# EAGLE design LOCO-Switch (EAGLE 9.7.0)

## Sheet 1 of 2
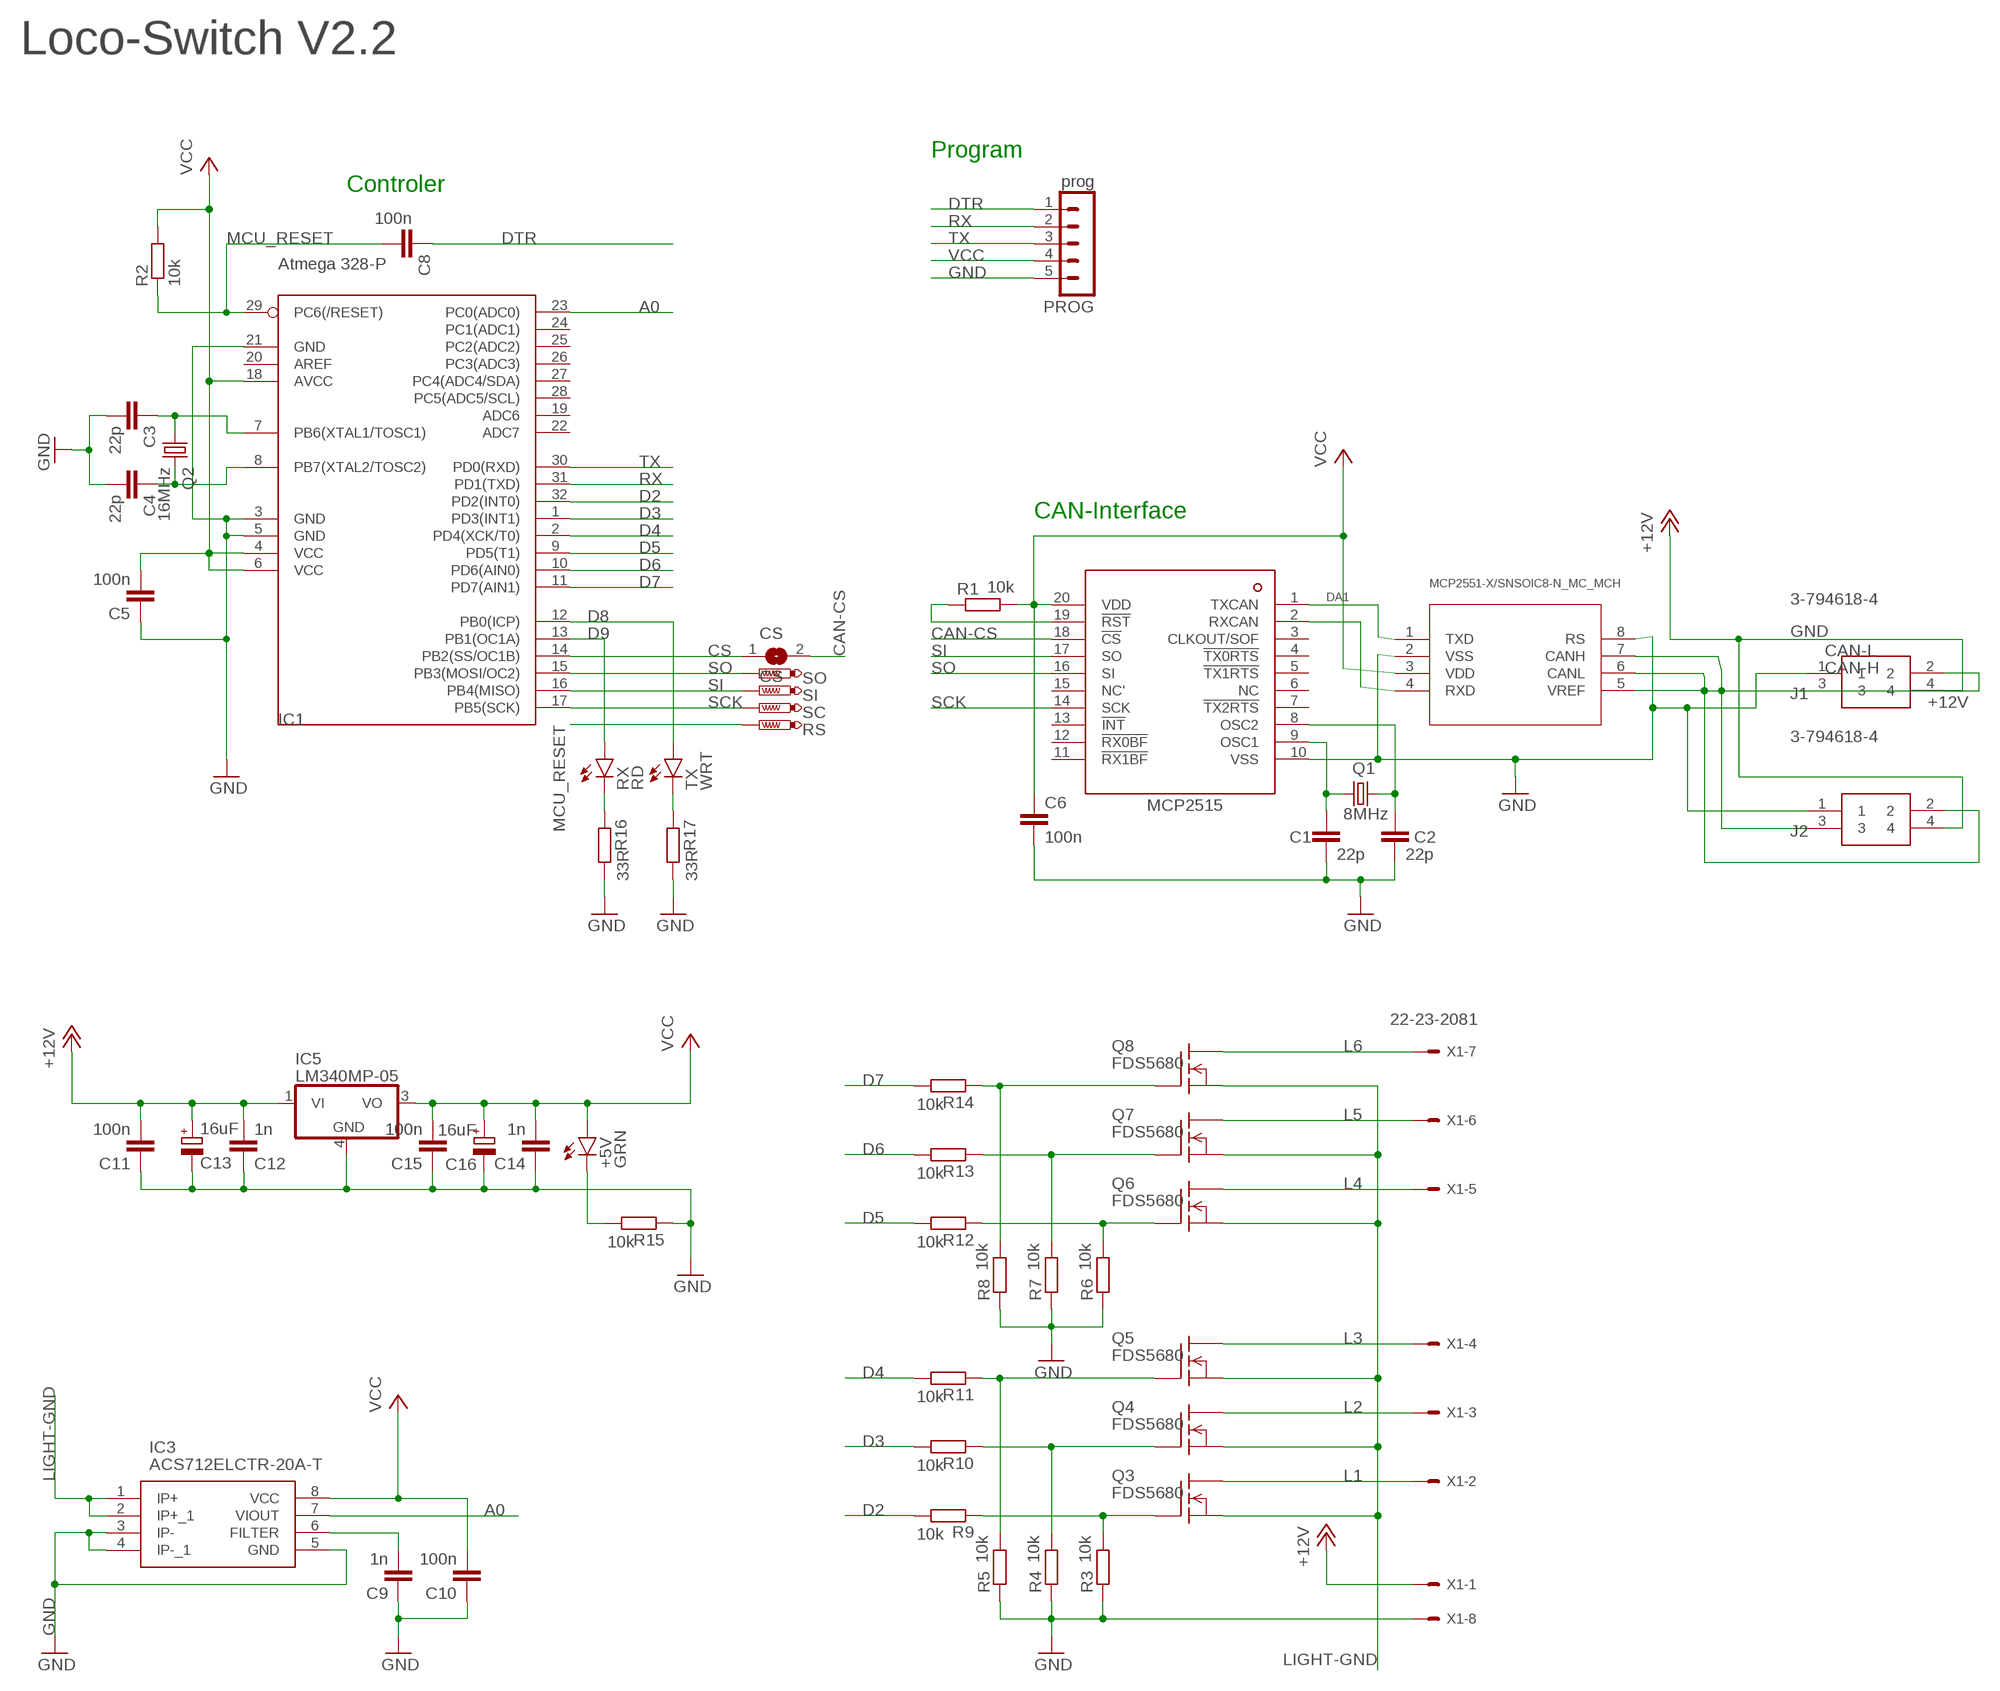
[diagram p0: schematic, sheet 1]

### Parts
+5V  GRN  LEDCHIP-LED0603  [CHIP-LED0603]
C1  22p  C-EUC0402K  [C0402K]
C2  22p  C-EUC0402K  [C0402K]
C3  22p  C-EUC0402K  [C0402K]
C4  22p  C-EUC0402K  [C0402K]
C5  100n  C-EUC0402K  [C0402K]
C6  100n  C-EUC0402K  [C0402K]
C8  100n  C-EUC0402K  [C0402K]
C9  1n  C-EUC0402K  [C0402K]
C10  100n  C-EUC0402K  [C0402K]
C11  100n  C-EUC0402K  [C0402K]
C12  1n  C-EUC0402K  [C0402K]
C13  16uF  CPOL-EUA/3216-18W  [A/3216-18W]
C14  1n  C-EUC0402K  [C0402K]
C15  100n  C-EUC0402K  [C0402K]
C16  16uF  CPOL-EUA/3216-18W  [A/3216-18W]
CS  CS  SJ  [SJ]
DA1  MCP2551-X/SNSOIC8-N_MC_MCH  [SOIC8-N_MC_MCH]
IC1  Atmega 328-P  MEGA8  [TQFP32-08]
IC2  MCP2515  [TSSOP20]
IC3  ACS712ELCTR-20A-T  [SOIC127P600X175-8N]
IC5  LM340MP-05  [SOT223]
J1  3-794618-4  [3-794618-4]
J2  3-794618-4  [3-794618-4]
PROG  prog  MA05-1  [MA05-1]
Q1  8MHz  CRYSTALHC49S  [HC49/S]
Q2  16MHz  CRYSTALHC49S  [HC49/S]
Q3  FDS5680  [SO-8]
Q4  FDS5680  [SO-8]
Q5  FDS5680  [SO-8]
Q6  FDS5680  [SO-8]
Q7  FDS5680  [SO-8]
Q8  FDS5680  [SO-8]
R1  10k  R-EU_R0603  [R0603]
R2  10k  R-EU_R0603  [R0603]
R3  10k  R-EU_R0603  [R0603]
R4  10k  R-EU_R0603  [R0603]
R5  10k  R-EU_R0603  [R0603]
R6  10k  R-EU_R0603  [R0603]
R7  10k  R-EU_R0603  [R0603]
R8  10k  R-EU_R0603  [R0603]
R9  10k  R-EU_R0603  [R0603]
R10  10k  R-EU_R0603  [R0603]
R11  10k  R-EU_R0603  [R0603]
R12  10k  R-EU_R0603  [R0603]
R13  10k  R-EU_R0603  [R0603]
R14  10k  R-EU_R0603  [R0603]
R15  10k  R-EU_R0603  [R0603]
R16  33R  R-EU_R0603  [R0603]
R17  33R  R-EU_R0603  [R0603]
RS  PTR1B1,27  [B1,27]
RX  RD  LEDCHIP-LED0603  [CHIP-LED0603]
SC  PTR1B1,27  [B1,27]
SI  PTR1B1,27  [B1,27]
SO  PTR1B1,27  [B1,27]
TX  WRT  LEDCHIP-LED0603  [CHIP-LED0603]
X1  22-23-2081  [22-23-2081]

### Nets
+12V: C11.2 C12.2 C13.+ IC5.1(VI) J1.4 J2.4 X1.1
A0: IC1.23(PC0(ADC0)) IC3.7(VIOUT)
CAN-CS: CS.2 IC2.18(!CS)
CAN-H: DA1.7(CANH) J1.3 J2.3
CAN-L: DA1.5(VREF) DA1.6(CANL) J1.2 J2.2
CAN-OCC1: C1.1 IC2.9(OSC1) Q1.1
CAN-OCC2: C2.1 IC2.8(OSC2) Q1.2
CS: CS.1 IC1.14(PB2(SS/OC1B))
D2: IC1.32(PD2(INT0)) R9.2
D3: IC1.1(PD3(INT1)) R10.2
D4: IC1.2(PD4(XCK/T0)) R11.2
D5: IC1.9(PD5(T1)) R12.2
D6: IC1.10(PD6(AIN0)) R13.2
D7: IC1.11(PD7(AIN1)) R14.2
D8: IC1.12(PB0(ICP)) TX.A
D9: IC1.13(PB1(OC1A)) RX.A
DTR: C8.1 PROG.1
GND: C1.2 C2.2 C3.2 C4.2 C5.1 C6.2 C9.1 C10.1 C11.1 C12.1 C13.- C14.1 C15.1 C16.- DA1.2(VSS) DA1.8(RS) IC1.3(GND) IC1.5(GND) IC1.21(GND) IC2.10(VSS) IC3.3(IP-) IC3.4(IP-_1) IC3.5(GND) IC5.4(GND) J1.1 J2.1 PROG.5 R3.1 R4.1 R5.1 R6.1 R7.1 R8.1 R15.1 R16.2 R17.2 X1.8
L1: Q3.5(D) Q3.6(D) Q3.7(D) Q3.8(D) X1.2
L2: Q4.5(D) Q4.6(D) Q4.7(D) Q4.8(D) X1.3
L3: Q5.5(D) Q5.6(D) Q5.7(D) Q5.8(D) X1.4
L4: Q6.5(D) Q6.6(D) Q6.7(D) Q6.8(D) X1.5
L5: Q7.5(D) Q7.6(D) Q7.7(D) Q7.8(D) X1.6
L6: Q8.5(D) Q8.6(D) Q8.7(D) Q8.8(D) X1.7
LIGHT-GND: IC3.1(IP+) IC3.2(IP+_1) Q3.1(S) Q3.2(S) Q3.3(S) Q4.1(S) Q4.2(S) Q4.3(S) Q5.1(S) Q5.2(S) Q5.3(S) Q6.1(S) Q6.2(S) Q6.3(S) Q7.1(S) Q7.2(S) Q7.3(S) Q8.1(S) Q8.2(S) Q8.3(S)
MCU_RESET: C8.2 IC1.29(PC6(/RESET)) R2.1 RS.TP
N$1: C9.2 IC3.6(FILTER)
N$2: Q3.4(G) R3.2 R9.1
N$3: Q4.4(G) R4.2 R10.1
N$4: Q5.4(G) R5.2 R11.1
N$5: Q6.4(G) R6.2 R12.1
N$6: IC2.19(!RST) R1.1
N$7: Q7.4(G) R7.2 R13.1
N$8: Q8.4(G) R8.2 R14.1
N$9: R16.1 RX.C
N$10: C3.1 IC1.7(PB6(XTAL1/TOSC1)) Q2.1
N$11: C4.1 IC1.8(PB7(XTAL2/TOSC2)) Q2.2
N$12: +5V.C R15.2
N$13: R17.1 TX.C
RX: IC1.31(PD1(TXD)) PROG.2
RXCAN: DA1.4(RXD) IC2.2(RXCAN)
SCK: IC1.17(PB5(SCK)) IC2.14(SCK) SC.TP
SI: IC1.16(PB4(MISO)) IC2.17(SO) SI.TP
SO: IC1.15(PB3(MOSI/OC2)) IC2.16(SI) SO.TP
TX: IC1.30(PD0(RXD)) PROG.3
TXCAN: DA1.1(TXD) IC2.1(TXCAN)
VCC: +5V.A C5.2 C6.1 C10.2 C14.2 C15.2 C16.+ DA1.3(VDD) IC1.4(VCC) IC1.6(VCC) IC1.18(AVCC) IC2.20(VDD) IC3.8(VCC) IC5.3(VO) PROG.4 R1.2 R2.2
Unconnected: IC1.19(ADC6) IC1.20(AREF) IC1.22(ADC7) IC1.24(PC1(ADC1)) IC1.25(PC2(ADC2)) IC1.26(PC3(ADC3)) IC1.27(PC4(ADC4/SDA)) IC1.28(PC5(ADC5/SCL)) IC2.3(CLKOUT/SOF) IC2.4(!TX0RTS) IC2.5(!TX1RTS) IC2.6(NC) IC2.7(!TX2RTS) IC2.11(!RX1BF) IC2.12(!RX0BF) IC2.13(!INT) IC2.15(NC')

### Notes on the sheet
- Loco-Switch V2.2
- Program
- Controler
- CAN-Interface

## Sheet 2 of 2

## Library data of the parts
+5V RX TX = led:LED: LED OSRAM: - CHIPLED LG R971, LG N971, LY N971, LG Q971, LY Q971, LO R971, LY R971 LH N974, LH R974 LS Q976, LO Q976, LY Q976 LO Q996 - Hyper CHIPLED LW Q18S LB Q993, LB Q99A, LB R99A - SideLED LS A670, LO A670, LY A670, LG A670, LP A670 LB A673, LV A673, LT A673, LW A673 LH A674 LY A675 LS A676, LA A676, LO A676, LY A676, LW A676 LS A679, LY A679, LG A679 - Hyper Micro SIDELED® LS Y876, LA Y876, LO Y876, LY Y876 LT Y87S - SmartLED LW L88C, LW L88S LB L89C, LB L89S, LG L890 LS L89K, LO L89K, LY L89K LS L896, LA L896, LO L896, LY L896 - TOPLED LS T670, LO T670, LY T670, LG T670, LP T670 LSG T670, LSP T670, LSY T670, LOP T670, LYG T670 LG T671, LOG T671, LSG T671 LB T673, LV T673, LT T673, LW T673 LH T674 LS T676, LA T676, LO T676, LY T676, LB T676, LH T676, LSB T676, LW T676 LB T67C, LV T67C, LT T67C, LS T67K, LO T67K, LY T67K, LW E67C LS E67B, LA E67B, LO E67B, LY E67B, LB E67C, LV E67C, LT E67C LW T67C LS T679, LY T679, LG T679 LS T770, LO T770, LY T770, LG T770, LP T770 LB T773, LV T773, LT T773, LW T773 LH T774 LS E675, LA E675, LY E675, LS T675 LS T776, LA T776, LO T776, LY T776, LB T776 LHGB T686 LT T68C, LB T68C - Hyper Mini TOPLED® LB M676 - Mini TOPLED Santana® LG M470 LS M47K, LO M47K, LY M47K Source: http://www.osram.convergy.de LUXEON: - LUMILED® LXK2-PW12-R00, LXK2-PW12-S00, LXK2-PW14-U00, LXK2-PW14-V00 LXK2-PM12-R00, LXK2-PM12-S00, LXK2-PM14-U00 LXK2-PE12-Q00, LXK2-PE12-R00, LXK2-PE12-S00, LXK2-PE14-T00, LXK2-PE14-U00 LXK2-PB12-K00, LXK2-PB12-L00, LXK2-PB12-M00, LXK2-PB14-N00, LXK2-PB14-P00, LXK2-PB14-Q00 LXK2-PR12-L00, LXK2-PR12-M00, LXK2-PR14-Q00, LXK2-PR14-R00 LXK2-PD12-Q00, LXK2-PD12-R00, LXK2-PD12-S00 LXK2-PH12-R00, LXK2-PH12-S00 LXK2-PL12-P00, LXK2-PL12-Q00, LXK2-PL12-R00 Source: www.luxeon.com KINGBRIGHT: KA-3528ASYC Source: www.kingbright.com
C1-C6 C8-C12 C14 C15 = rcl:C-EU: CAPACITOR, European symbol; SPICEPREFIX: C
C13 C16 = rcl:CPOL-EU: POLARIZED CAPACITOR, European symbol; SPICEPREFIX: C
CS = jumper:SJ: SMD solder JUMPER
DA1 = MCP2551:MCP2551-X/SN; COPYRIGHT: Copyright (C) 2023 Ultra Librarian. All rights reserved.; MANUFACTURER_PART_NUMBER: MCP2551-X/SN; MFR_NAME: Microchip
IC1 = atmel:MEGA8: MICROCONTROLLER 8 Kbytes FLASH, 1 kbytes SRAM, 512 bytes EEPROM, USART, 6-channel 10 bit ADC, 2-channel 8 bit ADC Pin compatible with Atmega48, ATMega88, ATMega168 Source: avr.lbr
IC2 = MCP2515:MCP2515: Microchip Technology’s MCP2515 is a stand-alone Controller Area Network (CAN) controller that implements the CAN specification, version 2.0B. It is capable of transmitting and receiving both standard and extended data and remote frames. The MCP2515 has two acceptance masks and six acceptance filters that are used to filter out unwanted messages, thereby reducing the host MCUs overhead. The MCP2515 interfaces with microcontrollers (MCUs) via an industry standard Serial Peripheral Interface (SPI).
IC3 = SamacSys_Parts:ACS712ELCTR-20A-T: ACS712ELCTR-20A-T, Hall Effect Sensor 5V 8-Pin SOIC, SOIC N Source: Datasheet <http://uk.rs-online.com/web/p/products/6807135P>; ALLIED_NUMBER: R1076682; DESCRIPTION: ACS712ELCTR-20A-T, Hall Effect Sensor 5V 8-Pin SOIC, SOIC N; HEIGHT: 1.75mm; MANUFACTURER_NAME: Allegro Microsystems; MANUFACTURER_PART_NUMBER: ACS712ELCTR-20A-T; RS_PART_NUMBER: 6807135P; RS_PRICE-STOCK: http://uk.rs-online.com/web/p/products/6807135P
IC5 = linear:LM340?-*: Positive VOLTAGE REGULATOR Source: http://cache.national.com/ds/LM/LM340.pdf
J1 J2 = Micro Mate-N-Lok:3-794618-4: 4 way 2 row r/a header Mate-N-Lok Source: Datasheet <https://rs.componentsearchengine.com/Datasheets/2/3-794618-4.pdf>; DESCRIPTION: 4 way 2 row r/a header Mate-N-Lok; HEIGHT: 7.37mm; MANUFACTURER_NAME: TE Connectivity; MANUFACTURER_PART_NUMBER: 3-794618-4
PROG = lst-b:MA05-1: PIN HEADER; OC_FARNELL: unknown; OC_NEWARK: unknown
Q1 Q2 = crystal:CRYSTAL: CRYSTAL; OC_FARNELL: 1667008; OC_NEWARK: unknown
Q3-Q8 = transistor-fet:FDS5680: 60V N-Channel PowerTrench TM MOSFET FAIRCHILD FDS5680.pdf
R1-R17 = rcl:R-EU_: RESISTOR, European symbol; SPICEPREFIX: R
RS SC SI SO = testpad:PTR1: TEST PIN
X1 = con-molex:22-23-2081: .100" (2.54mm) Center Header - 8 Pin; MF: MOLEX; MPN: 22-23-2081; OC_FARNELL: 1756826; OC_NEWARK: 01C7592

## Board
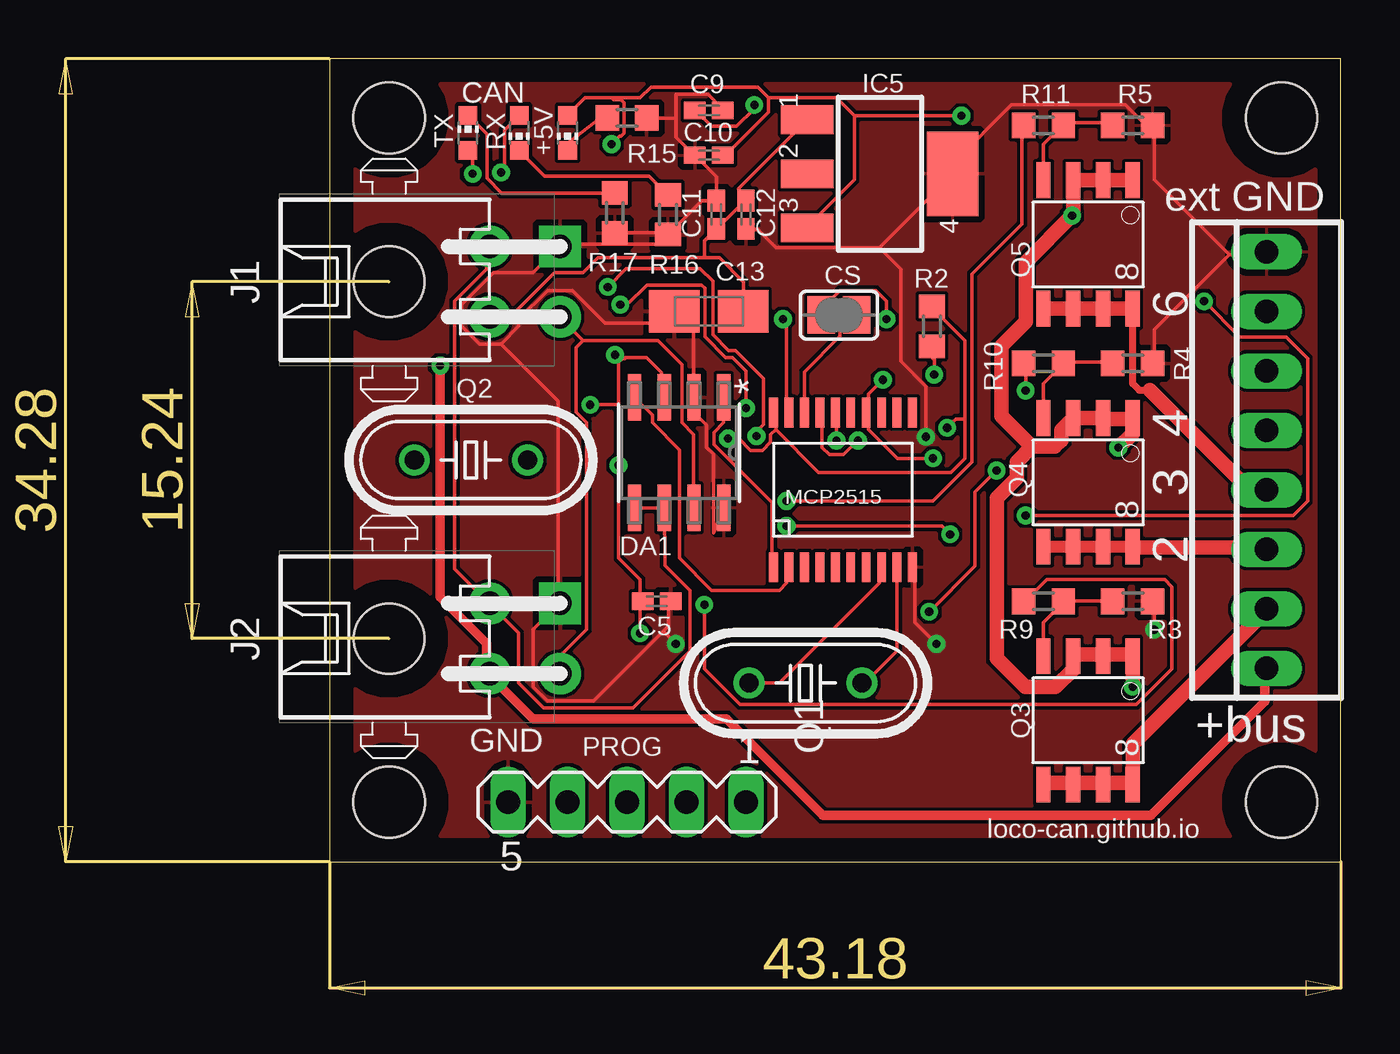
[diagram p1: board, top side]
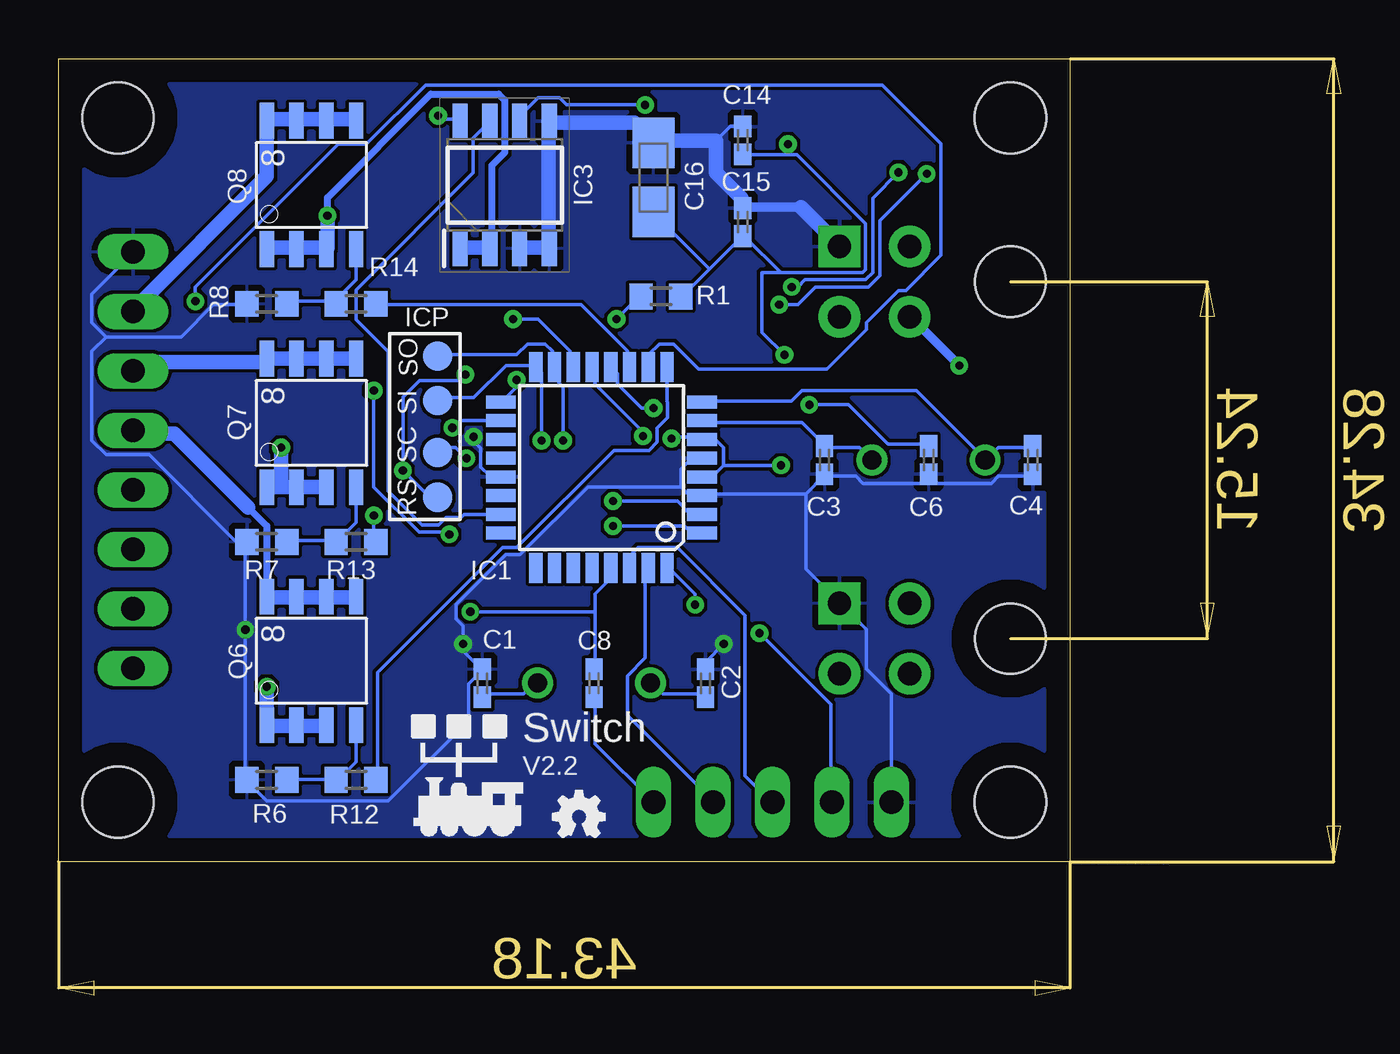
[diagram p2: board, bottom side, seen from below]

Size 43.18 x 34.29 mm. Coordinates in mm from the lower left corner, seen from the top.
Outline: 0,0 43.18,0 43.18,34.29 0,34.29 0,0
Copper layers (1*16): Top / Bottom
Stack-up Default Layer Stack: Top User Defined 0.035mm / Dielectric-1 User Defined 1.5mm / Bottom User Defined 0.035mm
Design rules "default": minimum track width 6mil, minimum drill 0.35mm, track to track 6mil, track to pad 6mil, pad to pad 6mil, via to via 6mil, smd to smd 6mil, copper to edge 40mil, drill to drill 6mil, minimum pad ring 10mil, minimum via ring 8mil, stop-mask expansion 4mil, vias tented up to drill 0mil, thermal gap 10mil
Holes 3.05 mm at 40.64,2.54 40.64,31.75 2.54,2.54 2.54,31.75

### Footprints (pad centres in the part's own frame; a part is rotated, then mirrored left to right if it is on the bottom)
CHIP-LED0603 = smd 0.8 x 0.8: A 0,-0.75; C 0,0.75
C0402K = smd 0.925 x 0.74: 1 -0.6,0; 2 0.6,0
A/3216-18W = smd 2.15 x 1.8: + 1.475,0; - -1.475,0
SJ = smd 1.168 x 1.6: 1 -0.762,0; 2 0.762,0
SOIC8-N_MC_MCH = smd 1.981 x 0.559: 1 -2.362,1.905; 2 -2.362,0.635; 3 -2.362,-0.635; 4 -2.362,-1.905; 5 2.362,-1.905; 6 2.362,-0.635; 7 2.362,0.635; 8 2.362,1.905
TQFP32-08 = smd 1.27 x 0.559: 1 -4.293,2.8; 2 -4.293,2; 3 -4.293,1.2; 4 -4.293,0.4; 5 -4.293,-0.4; 6 -4.293,-1.2; 7 -4.293,-2; 8 -4.293,-2.8; 17 4.293,-2.8; 18 4.293,-2; 19 4.293,-1.2; 20 4.293,-0.4; 21 4.293,0.4; 22 4.293,1.2; 23 4.293,2; 24 4.293,2.8 | smd 0.559 x 1.27: 9 -2.8,-4.293; 10 -2,-4.293; 11 -1.2,-4.293; 12 -0.4,-4.293; 13 0.4,-4.293; 14 1.2,-4.293; 15 2,-4.293; 16 2.8,-4.293; 25 2.8,4.293; 26 2,4.293; 27 1.2,4.293; 28 0.4,4.293; 29 -0.4,4.293; 30 -1.2,4.293; 31 -2,4.293; 32 -2.8,4.293
TSSOP20 = smd 1.27 x 0.381: 1 -3.302,2.642; 2 -3.302,1.981; 3 -3.302,1.321; 4 -3.302,0.66; 5 -3.302,0; 6 -3.302,-0.66; 7 -3.302,-1.321; 8 -3.302,-1.981; 9 -3.302,-2.642; 10 -3.302,-3.302; 11 3.302,-3.302; 12 3.302,-2.642; 13 3.302,-1.981; 14 3.302,-1.321; 15 3.302,-0.66; 16 3.302,0; 17 3.302,0.66; 18 3.302,1.321; 19 3.302,1.981; 20 3.302,2.642
SOIC127P600X175-8N = smd 1.525 x 0.65: 1 -2.712,1.905; 2 -2.712,0.635; 3 -2.712,-0.635; 4 -2.712,-1.905; 5 2.712,-1.905; 6 2.712,-0.635; 7 2.712,0.635; 8 2.712,1.905
SOT223 = smd 1.219 x 2.235: 1 -2.311,-3.099; 2 0,-3.099; 3 2.311,-3.099 | smd 3.6 x 2.2: 4 0,3.099
3-794618-4 = drill 1 pad 1.778 square: 1 1.5,-7.3 | drill 1 pad 1.778: 2 1.5,-4.3; 3 -1.5,-7.3; 4 -1.5,-4.3 | hole 3: 0,0
MA05-1 = drill 1.016 long: 1 -5.08,0; 2 -2.54,0; 3 0,0; 4 2.54,0; 5 5.08,0
HC49/S = drill 0.813: 1 -2.413,0; 2 2.413,0
SO-8 = smd 1.524 x 0.61: 1 -2.743,1.905; 2 -2.743,0.635; 3 -2.743,-0.635; 4 -2.743,-1.905; 5 2.743,-1.905; 6 2.743,-0.635; 7 2.743,0.635; 8 2.743,1.905
R0603 = smd 1 x 1.1: 1 -0.85,0; 2 0.85,0
B1,27 = smd 1.27 x 1.27: TP 0,0
22-23-2081 = drill 1 long: 1 -8.89,0; 2 -6.35,0; 3 -3.81,0; 4 -1.27,0; 5 1.27,0; 6 3.81,0; 7 6.35,0; 8 8.89,0

### Placement (x,y rotation side)
+5V  10.16,31.11 180 top
C1  25.08,7.62 90 bottom
C2  15.56,7.62 90 bottom
C3  10.48,17.14 270 bottom
C4  1.59,17.14 270 bottom
C5  13.97,11.11 180 top
C6  6.03,17.14 270 bottom
C8  20.32,7.62 90 bottom
C9  16.19,32.07 180 top
C10  16.19,30.16 0 top
C11  16.51,27.62 270 top
C12  17.78,27.62 90 top
C13  16.19,23.5 0 top
C14  13.97,30.8 270 bottom
C15  13.97,27.3 270 bottom
C16  17.78,29.21 270 bottom
CS  21.75,23.34 0 top
DA1  14.92,17.46 270 top
IC1  20,16.83 180 bottom
IC2  21.59,15.88 90 top
IC3  24.13,28.89 90 bottom
IC5  23.5,29.37 270 top
J1  2.54,24.77 90 top
J2  2.54,9.53 90 top
PROG  12.7,2.54 180 top
Q1  20.32,7.62 180 top
Q2  6.03,17.14 180 top
Q3  32.38,6.03 270 top
Q4  32.38,16.19 270 top
Q5  32.38,26.35 270 top
Q6  32.38,8.57 90 bottom
Q7  32.38,18.73 90 bottom
Q8  32.38,28.89 90 bottom
R1  17.46,24.13 0 bottom
R2  25.72,22.86 90 top
R3  34.29,11.11 180 top
R4  34.29,21.27 180 top
R5  34.29,31.43 180 top
R6  34.29,3.49 0 bottom
R7  34.29,13.65 0 bottom
R8  34.29,23.81 0 bottom
R9  30.48,11.11 180 top
R10  30.48,21.27 180 top
R11  30.48,31.43 180 top
R12  30.48,3.49 0 bottom
R13  30.48,13.65 0 bottom
R14  30.48,23.81 0 bottom
R15  12.7,31.75 180 top
R16  14.45,27.62 270 top
R17  12.18,27.7 270 top
RS  26.99,15.56 0 bottom
RX  8.1,31.11 180 top
SC  26.99,17.46 0 bottom
SI  26.99,19.68 0 bottom
SO  26.99,21.59 0 bottom
TX  5.91,31.11 0 top
X1  40.01,17.14 90 top

### Tracks (layer width: path | path; a pad name or v marks a point on that pad's centre or on a via)
+12V  (via drill 0.35)
  Top 0.152: C11.2 16,26.52 16,26.49 | 16,25.78 16,26.49 | C13.+ 17.67,24.75 16.64,25.78 16,25.78 | IC5.1 20.27,31.55 17.46,28.74 C12.2 17.73,28.22 16,26.49 | J1.4 6.86,23.32 7.77,23.32 9.6,25.15 10.82,25.15 11.46,25.78 16,25.78 | 6.86,7.92 J2.4 6.71,8.08
  Top 0.406: 6.86,7.92 8.69,6.09 16.94,6.09 21.06,1.97 35.06,1.97 39.93,6.83 39.93,8.23 X1.1 | v4.72,21.18 4.72,11.29 6.71,9.31 6.71,8.08
  Bottom 0.406: v4.72,21.18 6.71,23.16 J1.4
A0
  Bottom 0.152: IC3.7 25.48,30.89 25.48,29.41 30.48,24.41 30.48,23.14 29.11,21.77 29.11,15.82 27.66,14.38 26.95,14.38 26.63,14.69 26,14.69 25.86,14.83 IC1.23
CAN-CS
  Top 0.152: IC2.18 20.27,20.91 21.8,22.44 21.8,22.62 CS.2
CAN-H
  Top 0.152: 10.82,22.25 14.02,22.25 15.05,21.22 15.05,18.74 15.54,18.24 15.54,14.17 15.55,14.18 DA1.7 | 10.82,22.25 9.91,23.16 J1.3 | 10.82,22.25 10.52,21.95 10.52,19.2 10.97,18.75 10.97,9.91 9.91,8.84 9.91,8.08 J2.3
CAN-L
  Top 0.152: 14.29,15.08 14.33,13.54 14.33,12.65 15.39,11.58 15.39,8.99 12.95,6.55 9.14,6.55 8.08,7.62 8.08,9.75 6.86,10.97 J2.2 6.71,11.12 5.33,12.5 5.33,23.93 6.71,25.3 6.71,26.21 J1.2 | 14.29,15.08 DA1.6 | DA1.5 14.27,15.1 14.29,15.08
CAN-OCC1
  Top 0.152: IC2.9 24.23,8.99 22.86,7.62 Q1.1
  Bottom 0.152: C1.1 24.99,7.16 23.32,7.16 22.86,7.62 Q1.1
CAN-OCC2
  Top 0.152: Q1.2 19.2,7.62 23.47,11.89 23.47,12.5 IC2.8
  Bottom 0.152: C2.1 15.7,7.16 17.37,7.16 17.83,7.62 Q1.2
CS  (via drill 0.35)
  Top 0.152: v23.77,23.16 23.77,23.93 23.32,24.38 21.79,24.38 20.88,23.47 CS.1
  Bottom 0.152: v23.77,23.16 22.71,23.16 21.34,21.79 21.34,21.18 IC1.14
D2  (via drill 0.35)
  Top 0.152: v16,10.97 16,8.23 17.53,6.71 34.44,6.71 35.97,8.23 35.97,11.73 35.66,12.04 30.63,12.04 29.72,11.12 R9.2
  Bottom 0.152: v16,10.97 16,11.43 17.07,12.5 IC1.32
D3  (via drill 0.35)
  Top 0.152: v29.72,20.12 29.72,21.18 R10.2 | v19.51,14.33 26.14,14.33 v26.49,13.97
  Bottom 0.152: v19.51,14.33 16.46,14.33 16.31,14.17 15.85,14.17 IC1.1 | v26.49,13.97 26.59,14.07 27.79,14.07 29.72,16 v29.72,20.12
D4  (via drill 0.35)
  Top 0.152: v19.51,15.39 25.76,15.39 27.43,17.07 27.43,25.09 29.57,27.23 29.57,31.39 R11.2
  Bottom 0.152: v19.51,15.39 16.76,15.39 16.31,14.94 15.85,14.94 IC1.2
D5
  Bottom 0.152: R12.2 29.57,3.5 29.57,8.08 24.23,13.41 23.62,13.41 19.47,17.56 17.98,17.56 17.62,17.92 17.62,18.52 17.17,18.97 17.17,19.62 17.2,19.65 IC1.9
D6  (via drill 0.35)
  Top 0.152: v29.72,14.78 41.15,14.78 41.76,15.39 41.76,21.49 40.84,22.4 38.86,22.4 v37.34,23.93
  Bottom 0.152: v29.72,14.78 29.72,13.72 R13.2 | v37.34,23.93 37.34,24.54 31.24,30.63 30.04,30.63 27.52,33.16 8.01,33.16 5.5,30.66 5.5,25.89 7.01,24.38 7.32,24.38 8.69,23.01 8.69,22.71 10.36,21.03 15.85,21.03 16.92,22.1 17.53,22.1 17.98,21.64 17.98,21.18 IC1.10
D7
  Bottom 0.152: R14.2 29.57,23.77 20.88,23.77 18.9,21.79 18.9,21.18 IC1.11
D8  (via drill 0.35)
  Top 0.152: v12.41,23.78 12.71,23.78 13.55,24.62 15.89,24.62 16.02,24.49 16.02,22.41 16.91,21.52 17.2,21.52 17.78,20.94 v17.78,19.37 | TX.A 6.11,30.16 v6.11,29.37
  Bottom 0.152: IC1.12 19.31,20.83 19.31,20.39 18.29,19.37 v17.78,19.37 | v12.41,23.78 11.62,23.78 10.86,24.54 8.6,24.54 8.11,25.03 8.11,27.37 v6.11,29.37
D9  (via drill 0.35)
  Top 0.152: v18.23,18.17 18.23,18.35 18.53,18.65 18.53,20.62 17.33,21.82 17.04,21.82 16.36,22.5 16.36,24.78 15.82,25.32 12.66,25.32 v11.88,24.54 | v7.32,29.43 7.47,29.57 7.47,31.24 RX.A
  Bottom 0.152: IC1.13 20.27,21.03 20.27,20.39 18.23,18.35 v18.23,18.17 | v11.88,24.54 11.61,24.54 11.31,24.84 8.73,24.84 8.42,25.16 8.42,28.34 v7.32,29.43
DTR
  Bottom 0.152: PROG.1 20.27,5.03 20.27,7.01 C8.1
GND  (via drill 0.35)
  Top 0.152: v35.2,9.91 35.2,10.97 R3.1 | v25.91,9.3 24.99,10.21 24.99,12.5 IC2.10 | 38.41,25.91 35.2,22.71 35.2,21.34 R4.1 | 38.41,25.91 39.93,25.91 X1.8 | 38.41,25.91 35.2,29.11 35.2,31.39 R5.1 35.05,31.55 34.75,31.55 33.98,32.31 29.11,32.31 26.67,29.87 26.67,29.41 IC5.4 26.52,29.26 23.47,26.21 | 23.47,26.21 19.05,26.21 18.29,26.98 17.86,26.98 C12.1 | 23.47,26.21 24.38,25.3 24.38,21.37 25.46,20.29 v25.46,18.14 | 14.17,9.75 11.28,6.86 9.3,6.86 8.69,7.47 8.69,9.91 9.75,10.97 J2.1 9.75,11.12 9.75,19.66 7.32,22.1 | 14.17,9.75 14.48,10.06 14.48,10.97 C5.1 | v14.78,9.3 14.33,9.75 14.17,9.75 | C9.1 16.76,32.16 16.15,32.77 14.78,32.77 14.78,31.75 | 14.78,31.75 R15.1 | R16.2 15.9,28.22 C11.1 16.51,29.25 C10.1 15.54,30.18 14.78,30.94 14.78,31.75 | R16.2 14.24,26.36 9.91,26.36 J1.1 9.75,26.21 8.69,25.15 7.01,25.15 5.64,23.77 5.64,22.86 6.4,22.1 7.32,22.1 | 7.32,22.1 8.08,22.86 8.08,23.16 9.3,24.38 10.36,24.38 11.76,22.99 14.21,22.99 C13.- 14.78,23.47 15.54,22.71 15.54,19.79 DA1.2 15.7,19.64 15.7,19.05 16.1,18.64 16.1,17.69 16.39,17.4 16.39,14.03 DA1.8 | R17.2 14.37,26.85 R16.2
  Bottom 0.152: 41.15,22.4 37.95,22.4 36.58,23.77 35.2,23.77 R8.1 | 41.15,22.4 41.76,23.01 41.76,24.23 40.08,25.91 X1.8 | IC1.21 24.38,16.46 24.76,16.46 25.16,16.85 25.16,17.66 25.46,17.96 v25.46,18.14 | 41.15,22.4 41.76,21.79 41.76,17.98 41.15,17.37 39.32,17.37 35.66,13.72 35.2,13.72 R7.1 35.2,13.56 v35.2,9.91 35.2,3.5 R6.1 35.05,3.35 34.29,2.59 29.11,2.59 25.68,6.02 25.68,7.58 25.08,8.18 C1.2 25.15,8.23 25.91,8.99 v25.91,9.3 25.91,10.06 26.21,10.36 26.21,10.97 24.08,13.11 23.47,13.11 20.57,16 16.61,16 | 16.61,16 16.31,15.7 15.85,15.7 IC1.3 15.7,15.7 11.28,15.7 | 16.61,16 16.61,16.76 16.15,17.22 15.85,17.22 IC1.5 | C4.2 1.68,16.46 3.05,16.46 3.35,16.15 5.64,16.15 5.94,16.46 C6.2 6.1,16.46 6.4,16.15 8.84,16.15 9.14,16.46 10.36,16.46 C3.2 10.52,16.46 11.28,15.7 | v14.78,9.3 15.54,8.53 15.54,8.23 C2.2 | PROG.5 7.62,7.16 8.69,8.23 8.69,9.91 9.75,10.97 J2.1 9.91,11.12 11.28,12.5 11.28,15.7 | 14.02,28.04 C15.1 | 23.47,26.21 IC3.3 | 18.59,31.55 17.83,30.79 C16.- | 22.1,31.55 IC3.5 22.25,31.55 | 22.25,26.21 IC3.4 | C14.1 14.5,31.4 15.11,30.79
  Bottom 0.406: C15.1 13.93,27.94 11.48,27.94
  Bottom 0.61: 14.02,28.04 14.02,28.32 15.11,29.41 15.11,30.79 17.67,30.79 C16.- | 23.47,26.21 22.25,26.21 22.25,31.55 | 18.59,31.55 22.1,31.55 | 11.48,27.94 9.91,26.36 J1.1
  pour Top: 0,34.29 43.18,34.29 43.18,0 0,0
  pour Bottom: 43.18,34.29 0,34.29 0,0 43.18,0
L1
  Top 0.152: 30.48,3.35 Q3.5 | 31.7,3.35 Q3.6 31.85,3.35 | 32.92,3.35 Q3.7 | 34.29,3.35 Q3.8
  Top 0.61: 31.7,3.35 30.48,3.35 | 31.85,3.35 32.92,3.35 | Q3.7 33.07,3.35 34.29,3.35 34.29,5.03 39.93,10.67 X1.2
L2
  Top 0.152: 34.44,13.41 Q4.8
  Top 0.508: Q4.5 Q4.6 Q4.7 Q4.8
  Top 0.61: 34.44,13.41 39.93,13.41 X1.3
L3
  Top 0.152: 30.48,23.62 Q5.5 | 31.7,23.62 Q5.6 | 32.92,23.62 Q5.7 33.07,23.62 | 34.29,23.62 Q5.8
  Top 0.305: Q5.8 34.29,20.41 34.57,20.13 35.03,20.13
  Top 0.61: 31.7,23.62 30.48,23.62 | 32.92,23.62 31.85,23.62 Q5.6 | 33.07,23.62 34.29,23.62 | X1.4 39.28,15.88 35.03,20.13
L4
  Bottom 0.152: 30.48,11.28 Q6.5 | 31.7,11.28 Q6.6 31.85,11.28 | 32.92,11.28 Q6.7 33.07,11.28 | 34.29,11.28 Q6.8 | 35.08,15.12 35.08,15.13
  Bottom 0.305: 35.08,15.13 34.29,14.33 Q6.8
  Bottom 0.61: 31.7,11.28 30.48,11.28 | 31.85,11.28 32.92,11.28 | 33.07,11.28 34.29,11.28 | 35.08,15.12 38.25,18.29 39.93,18.29 X1.5
L5
  Bottom 0.152: Q7.5 | 31.7,21.49 Q7.6 31.85,21.49 | 32.92,21.49 Q7.7 33.07,21.49 | Q7.8 34.29,21.34
  Bottom 0.61: 31.7,21.49 Q7.5 | 31.85,21.49 32.92,21.49 | 33.07,21.49 Q7.8 | 34.29,21.34 39.62,21.34 X1.6
L6
  Bottom 0.152: 30.48,31.7 Q8.5 | 31.7,31.7 Q8.6 31.85,31.7 | 32.92,31.7 Q8.7 33.07,31.7 | 34.29,31.7 Q8.8
  Bottom 0.61: 31.7,31.7 30.48,31.7 | 31.85,31.7 32.92,31.7 | 33.07,31.7 34.29,31.7 | Q8.8 34.29,29.26 39.93,23.62 X1.7
LIGHT-GND  (via drill 0.35)
  Top 0.152: 31.85,8.84 Q3.3 | 32.92,8.84 Q3.2 33.07,8.84 | 34.29,8.84 Q3.1 | 33.07,18.9 Q4.2
  Top 0.61: 32.92,8.84 31.85,8.84 | 33.07,8.84 34.29,8.84 | Q3.1 v34.29,7.47 | Q5.1 Q5.2 Q5.3 31.75,27.64 v31.7,27.58 29.72,25.6 29.72,23.06 28.67,22.01 28.67,19.03 29.99,17.72 | 33.07,18.9 34.25,18.9 Q4.1 34.29,18.29 v33.68,17.68 | Q4.2 Q4.3 31.24,18.43 31.24,17.98 30.97,17.72 29.99,17.72 | Q3.3 31.75,8.21 31,7.46 29.7,7.46 28.48,8.68 28.48,15.52 29.34,16.37 29.34,17.07 29.99,17.72
  Bottom 0.152: 24.84,26.21 IC3.2 24.69,26.21 | 25.91,26.21 IC3.1 | 31.85,26.21 Q8.3 31.7,26.21 | 32.92,26.21 Q8.2 33.07,26.21 | 34.29,26.21 Q8.1 | 31.85,5.79 Q6.3 | 32.92,5.79 Q6.2 33.07,5.79 | 34.29,5.79 Q6.1 | 31.85,16 Q7.3 | 32.92,16 Q7.2 33.07,16 | 34.29,16 Q7.1
  Bottom 0.305: 24.69,26.21 24.69,29.72 24.13,30.28 24.13,32.51 24.39,32.77 27.29,32.77 31.7,28.36 v31.7,27.58
  Bottom 0.61: 25.91,26.21 24.84,26.21 | 32.92,26.21 31.85,26.21 | 33.07,26.21 34.29,26.21 | 31.7,26.21 v31.7,27.58 | 32.92,5.79 31.85,5.79 | 33.07,5.79 34.29,5.79 | v34.29,7.47 Q6.1 | 32.92,16 31.85,16 | 33.07,16 33.68,16 | 33.68,16 34.29,16 | v33.68,17.68 33.68,16
MCU_RESET  (via drill 0.35)
  Top 0.152: v28.48,16.7 27.56,15.78 27.56,12.62 v25.6,10.67 | R2.1 25.76,21.95 25.76,21.49 25.82,21.43 v25.82,20.8
  Bottom 0.152: 20.27,10.67 20.27,11.43 19.66,12.04 19.66,12.5 IC1.29 | 20.27,10.67 20.27,8.23 C8.2 | 20.27,10.67 v25.6,10.67 | RS.TP 27.34,15.56 v28.48,16.7 28.48,19.83 27.76,20.55 26.06,20.55 v25.82,20.8
N$1  (via drill 0.35)
  Top 0.152: v18.14,32.31 18.14,32.16 17.37,31.39 16.31,31.39 15.7,32 C9.2
  Bottom 0.152: v18.14,32.31 21.49,32.31 21.79,32.61 22.71,32.61 23.62,31.7 IC3.6
N$2
  Top 0.152: R3.2 33.38,11.12 31.39,11.12 R9.1 31.24,10.97 30.48,10.21 Q3.4
N$3
  Top 0.152: R4.2 33.38,21.34 31.39,21.34 R10.1 31.24,21.18 30.48,20.42 Q4.4
N$4
  Top 0.152: R5.2 33.38,31.55 31.39,31.55 R11.1 31.24,31.39 30.48,30.63 Q5.4
N$5
  Bottom 0.152: R6.2 33.38,3.5 31.39,3.5 R12.1 31.24,3.5 30.48,4.27 Q6.4
N$6  (via drill 0.35)
  Top 0.152: v19.36,23.16 19.51,23.01 19.51,19.2 IC2.19
  Bottom 0.152: v19.36,23.16 18.44,24.08 R1.1
N$7
  Bottom 0.152: R7.2 33.38,13.72 31.39,13.72 R13.1 31.24,13.72 30.48,14.48 Q7.4
N$8
  Bottom 0.152: 31.39,23.93 33.38,23.93 R8.2 | Q8.4 30.48,24.84 31.39,23.93 | 31.39,23.93 R14.1
N$9
  Top 0.152: RX.C 9.18,29.28 13.64,29.28 R16.1
N$10
  Bottom 0.152: Q2.1 8.53,17.22 8.99,17.68 10.36,17.68 C3.1 10.52,17.83 11.43,18.75 15.7,18.75 IC1.7
N$11
  Bottom 0.152: C4.1 1.68,17.68 3.05,17.68 3.5,17.22 Q2.2 3.66,17.22 6.55,20.12 11.43,20.12 11.89,19.66 15.7,19.66 IC1.8
N$12
  Top 0.152: +5V.C 10.25,30.73 11.55,31.75 R15.2
N$13
  Top 0.152: R17.1 7.35,28.55 6.72,29.18 6.72,31.05 TX.C
RX
  Bottom 0.152: IC1.31 18.14,12.5 18.14,8.69 18.9,7.92 18.9,6.25 15.24,2.59 PROG.2
RXCAN
  Top 0.152: IC2.2 19.51,12.5 19.51,11.89 19.2,11.58 16.31,11.58 14.94,12.95 14.94,17.58 13.78,18.74 13.78,19.06 DA1.4
SCK  (via drill 0.35)
  Top 0.152: v23.62,20.57 23.01,19.96 23.01,19.2 IC2.14 23.01,19.05 23.01,18.44 24.23,17.22 v25.77,17.22
  Bottom 0.152: v23.62,20.57 23.62,20.27 24.23,19.66 IC1.17 | SC.TP 26.93,17.68 26.23,17.68 v25.77,17.22
SI  (via drill 0.35)
  Top 0.152: v22.55,17.98 21.95,17.37 21.34,17.37 21.03,17.68 21.03,19.05 IC2.17
  Bottom 0.152: v22.55,17.98 22.55,20.88 22.71,21.03 IC1.16 22.86,21.18 24.08,21.18 25.45,19.81 26.96,19.81 SI.TP
SO  (via drill 0.35)
  Top 0.152: v21.64,17.98 21.64,19.05 IC2.16
  Bottom 0.152: v21.64,17.98 21.64,20.27 21.95,20.57 21.95,21.03 IC1.15 22.1,21.18 22.1,21.79 22.4,22.1 23.16,22.1 23.62,21.64 26.96,21.64 SO.TP
TX
  Bottom 0.152: IC1.30 18.75,12.65 18.75,13.11 18.44,13.41 16.76,13.41 13.87,10.52 13.87,3.66 12.8,2.59 PROG.3
TXCAN
  Top 0.152: IC2.1 18.9,12.65 18.9,15.32 16.41,17.82 16.41,18.32 16.83,18.74 DA1.1
VCC  (via drill 0.35)
  Top 0.152: 12.04,32.61 13.26,32.61 13.72,33.07 18.29,33.07 18.75,32.61 | 12.04,32.61 10.91,32.61 +5V.A | 18.75,32.61 18.75,32 16.92,30.18 C10.2 | 22.4,31.85 v26.98,31.85 | 22.4,31.85 21.64,32.61 18.75,32.61 | 22.4,31.85 22.4,29.11 20.42,27.13 IC5.3 | 27.13,18.9 27.13,17.22 26.52,16.61 20.88,16.61 19.05,18.44 | 27.13,18.9 27.13,22.25 25.76,23.62 R2.2 | 19.05,18.44 19.05,19.05 IC2.20 | 12.34,19.51 12.34,21.34 12.5,21.49 | v12.34,16.92 12.34,19.51 | v12.34,16.92 12.34,12.95 13.26,12.04 13.26,11.12 C5.2 13.26,10.97 v13.26,9.75 | DA1.3 14.17,19.79 14.17,20.88 13.53,21.52 12.64,21.52 12.61,21.49 12.5,21.49 | 12.34,19.51 v11.12,19.51 | v12.19,21.64 12.34,21.64 12.5,21.49 | 27.13,18.9 26.74,18.9 v26.36,18.52 | 12.04,32.61 12.12,32.53 12.45,32.53 12.58,32.4 12.58,31.11 12.45,30.97 12.38,30.97 v12.04,30.63 | 19.05,18.44 18.83,18.22 18.83,17.92 18.48,17.56 17.98,17.56 17.47,18.07 v17.01,18.07 | v12.34,16.92
  Bottom 0.152: 15.39,25.3 16.61,24.08 R1.2 | 15.39,25.3 14.02,26.67 C15.2 13.87,26.67 12.34,25.15 | 12.04,30.18 13.87,30.18 C14.2 | 12.34,25.15 13.14,25.15 13.14,22.59 v12.19,21.64 | 15.39,25.3 17.68,27.58 C16.+ | v26.98,31.85 26.82,31.7 26.06,31.7 IC3.8 | v12.04,30.63 12.04,30.18 | 14.78,16.92 15.24,16.46 15.7,16.46 IC1.4 | 14.78,16.92 14.78,17.68 15.09,17.98 15.7,17.98 IC1.6 15.85,18.14 16.94,18.14 v17.01,18.07 | v11.12,19.51 9.45,19.51 7.77,17.83 6.1,17.83 C6.1 | 14.78,16.92 v12.34,16.92 | v13.26,9.75 10.21,6.71 10.21,2.59 PROG.4 | v26.36,18.52 26.06,18.82 26,18.82 25.99,18.83 IC1.18 | 12.34,25.15 11.44,25.15 11.43,25.15 8.86,25.15 8.72,25.28 8.72,27.25 11.65,30.18 12.04,30.18

### Text on the board
tNames: CAN | ext GND | 6 | 4 | 3 | 2 | +bus | GND | loco-can.github.io
bNames: ICP | Switch | V2.2 | C:/Users/Tom/Nextcloud/Technik/Projekte/Eisenbahn/Gartenbahn/Loco-CAN/Loco-CAN-Hardware/Graphics/Loco-can Logo.bmp | C:/Users/Tom/Nextcloud/Technik/Projekte/Eisenbahn/Gartenbahn/Loco-CAN/Loco-CAN-Hardware/Graphics/oshw.bmp